# EAGLE design TDA2003-Amplifier (EAGLE 7.2.0)
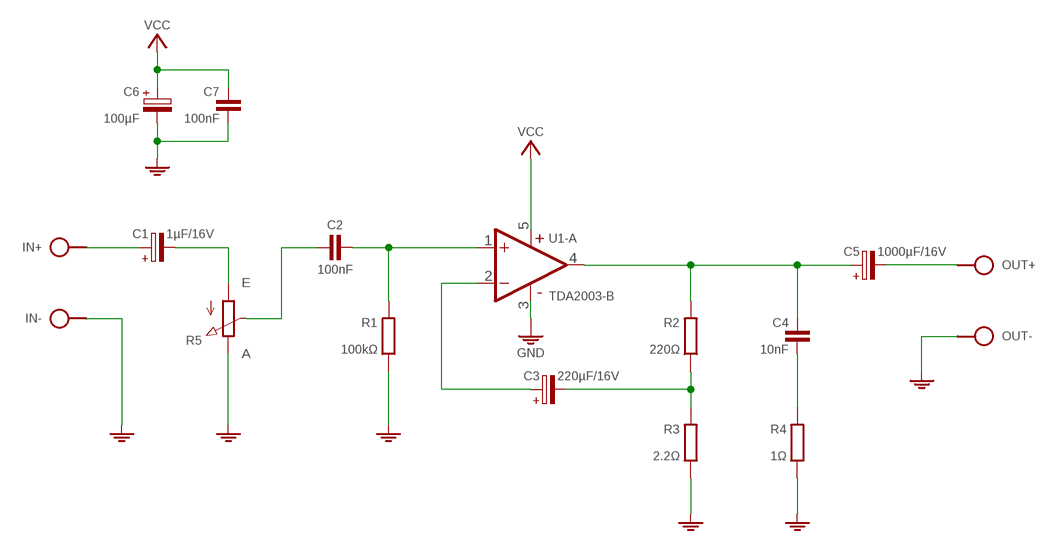
[diagram p0: schematic, sheet 1]

## Parts
C1  1µF/16V  CPOL-HE2,5-5  [E2,5-5]
C2  100nF  C-H050-024X044  [C050-024X044]
C3  220µF/16V  CPOL-HE2,5-5  [E2,5-5]
C4  10nF  C050-020X044/V  [C050-020X044/V]
C5  1000µF/16V  CPOL-HE5-5  [E5-5]
C6  100µF  CPOLE5-5/V  [E5-5/V]
C7  100nF  C050-024X044  [C050-024X044]
IN  SPAD+--+  [SPAD-+]
OUT  SPAD+-+-  [SPAD+-]
R1  100kΩ  R0204/10  [0204/10]
R2  220Ω  R0204/10  [0204/10]
R3  2.2Ω  R0204/10  [0204/10]
R4  1Ω  R0207/10  [0207/10]
R5  POT  [POT]
S1  VCC_GNDPWR-L  [PWR-L]
U1  TDA2003-B  [TO220-B5]

## Nets
GND: C6.- C7.2 IN.1 OUT.1 R1.2 R3.2 R4.2 R5.E S1.1 U1.3(-B:V-)
N$1: C4.1 C5.+ R2.1 U1.4(-A:OUT)
N$2: C4.2 R4.1
N$3: C5.- OUT.2
N$4: C1.- R5.A
N$5: C3.- R2.2 R3.1
N$6: C3.+ U1.2(-A:-IN)
N$7: C2.2 R1.1 U1.1(-A:+IN)
N$8: C2.1 R5.S
N$9: C1.+ IN.2
VCC: C6.+ C7.1 S1.2 U1.5(-B:V+)

## Library data of the parts
C1 C3 C5 = c:CPOL-H
C2 = c:C-H
C4 C7 = c:C: CAPACITOR, European symbol
C6 = c:CPOL: POLARIZED CAPACITOR, European symbol
IN OUT = pad:SPAD+-
R1-R4 = r:R: RESISTOR, European symbol
R5 = r:POT
S1 = pad:VCC_GND
U1 = ic:TDA2003

## Board
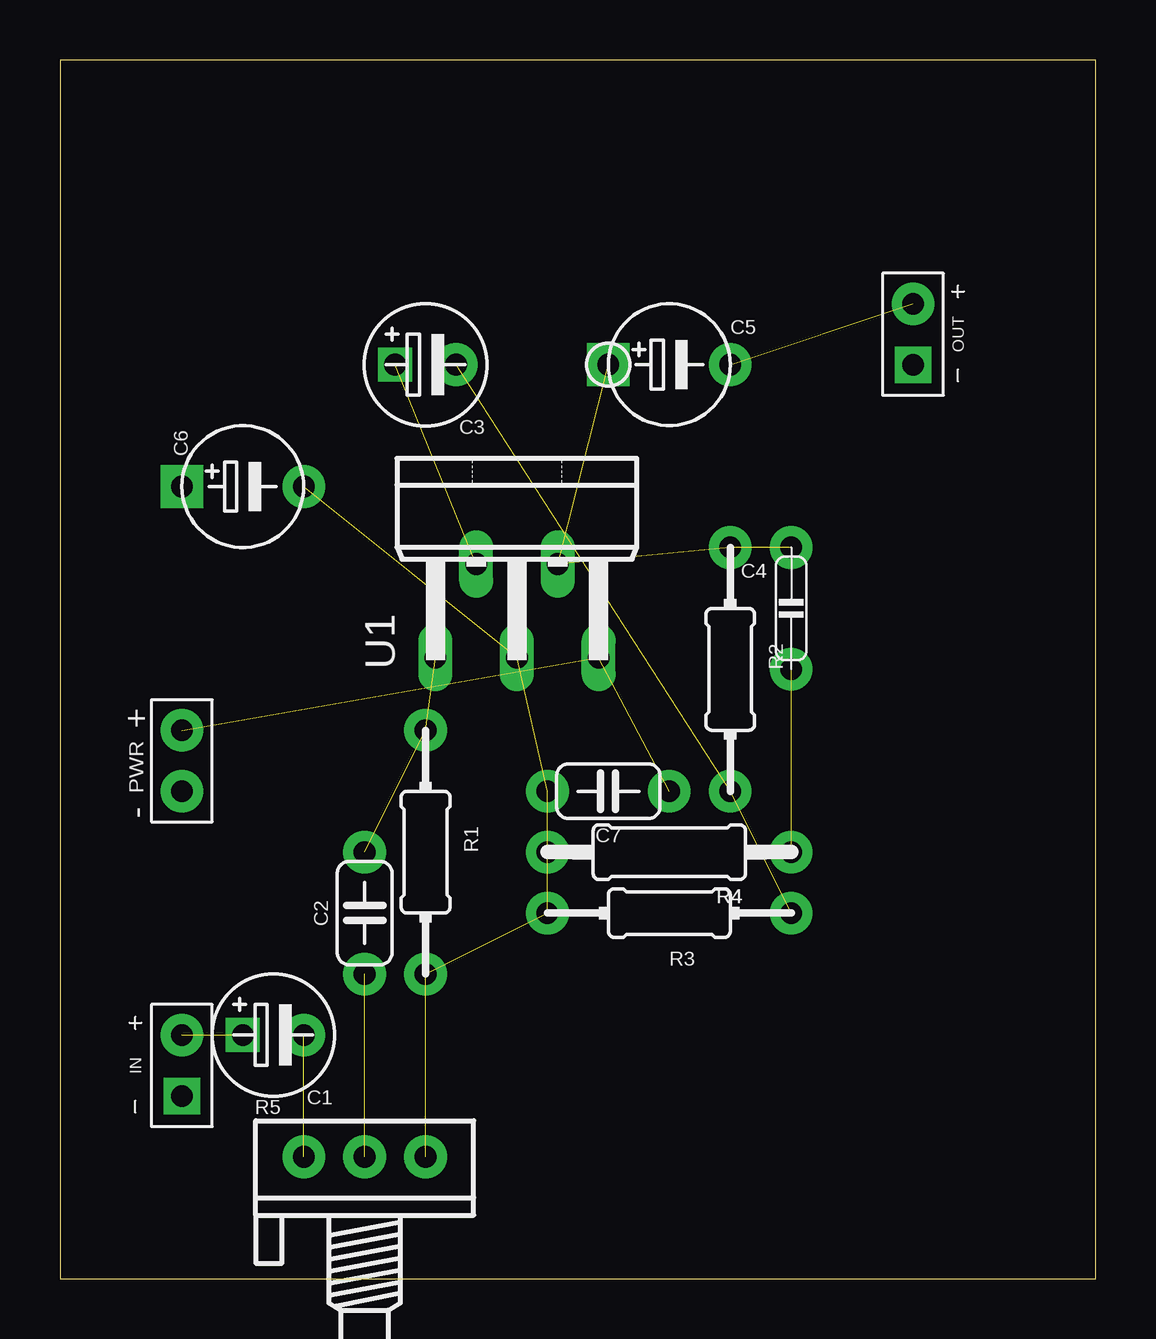
[diagram p1: board, top side]
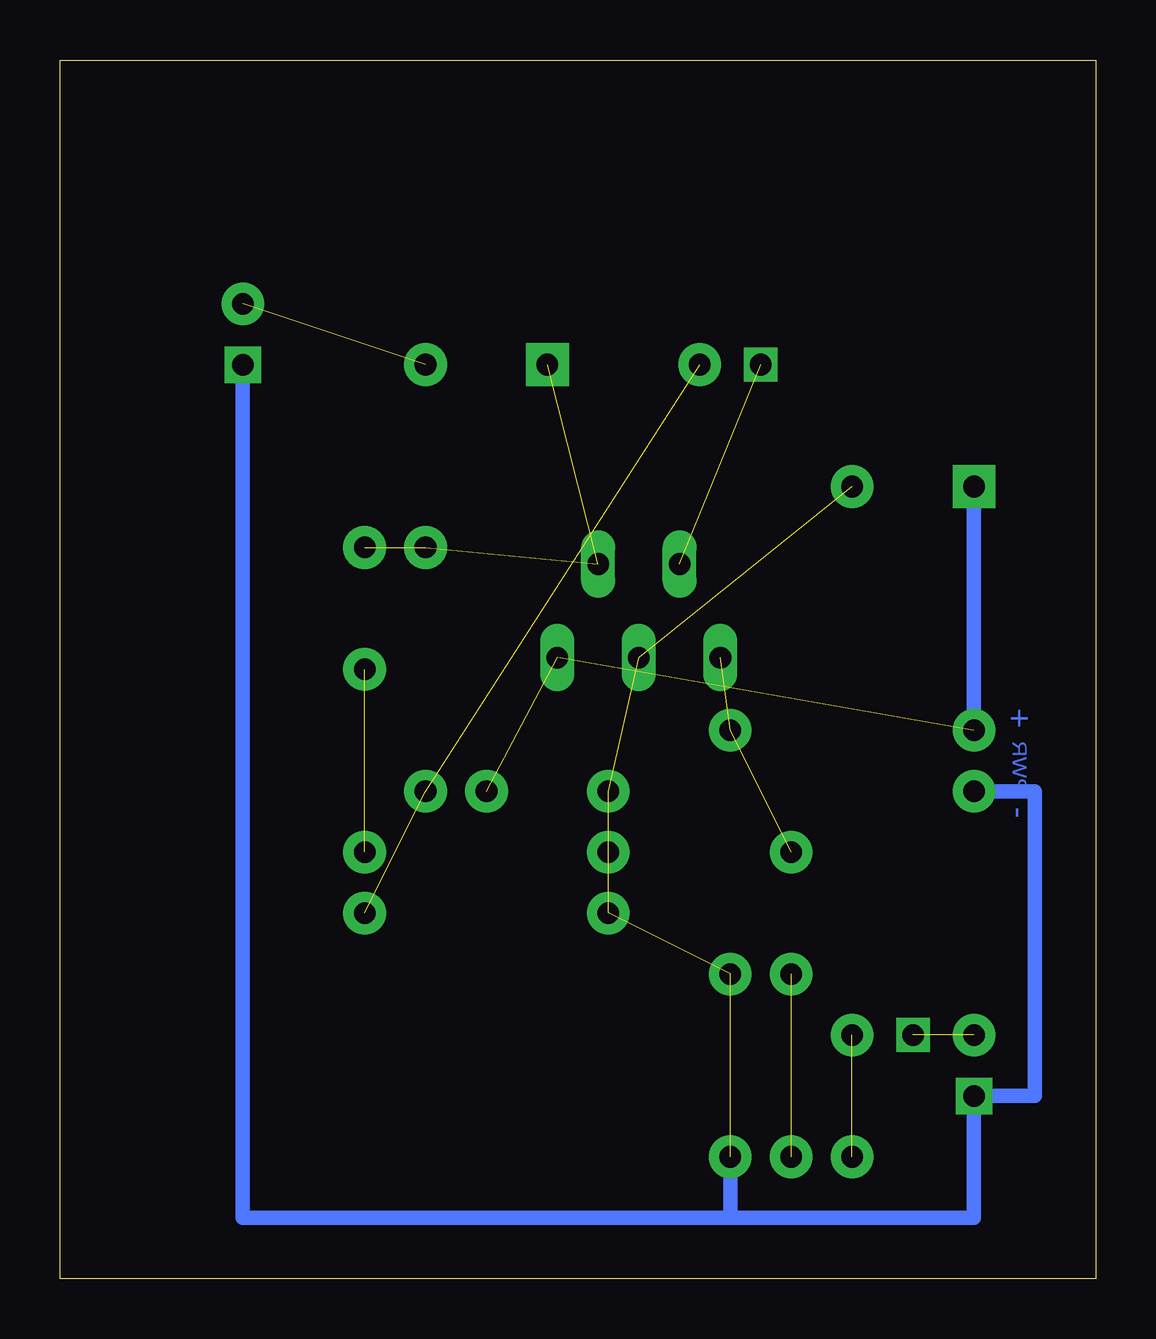
[diagram p2: board, bottom side, seen from below]

Size 43.18 x 50.8 mm. Coordinates in mm from the lower left corner, seen from the top.
Outline: 0,0 43.18,0 43.18,50.8 0,50.8 0,0
Copper layers (1*16): Top 0.035mm / dielectric 1.5mm / Bottom 0.035mm
Design rules "default": minimum track width 10mil, minimum drill 24mil, track to track 8mil, track to pad 8mil, pad to pad 8mil, via to via 8mil, smd to smd 8mil, copper to edge 40mil, drill to drill 8mil, minimum pad ring 10mil, minimum via ring 8mil, stop-mask expansion 4mil, vias tented up to drill 0mil, thermal gap 10mil

### Footprints (pad centres in the part's own frame; a part is rotated, then mirrored left to right if it is on the bottom)
E2,5-5 = drill 0.9 square: + 1.27,0 | drill 0.9 pad 1.778: - -1.27,0
C050-024X044 = drill 0.9 pad 1.778: 1 -2.54,0; 2 2.54,0
C050-020X044/V = drill 0.9 pad 1.778: 1 0,2.54; 2 0,-2.54
E5-5 = drill 0.9 pad 1.778 square: + -2.54,0 | drill 0.9 pad 1.778: - 2.54,0
E5-5/V = drill 0.9 pad 1.778 square: + 0,2.54 | drill 0.9 pad 1.778: - 0,-2.54
SPAD-+ = drill 0.9 pad 1.524 square: 1 0,-1.27 | drill 0.9 pad 1.778: 2 0,1.27
SPAD+- = drill 0.9 pad 1.524 square: 1 0,-1.27 | drill 0.9 pad 1.778: 2 0,1.27
0204/10 = drill 0.9 pad 1.778: 1 -5.08,0; 2 5.08,0
0207/10 = drill 0.9 pad 1.778: 1 -5.08,0; 2 5.08,0
POT = drill 0.9 pad 1.778: A -2.54,0; E 2.54,0; S 0,0
PWR-L = drill 0.9 pad 1.778: 1 0,0; 2 0,2.54
TO220-B5 = drill 0.9 long: 1 -3.4,-8.4; 2 -1.7,-4.5; 3 0,-8.4; 4 1.7,-4.5; 5 3.4,-8.4

### Placement (x,y rotation side)
C1  8.89,10.16 180 top
C2  12.7,15.24 90 top
C3  15.24,38.1 180 top
C4  30.48,27.94 0 top
C5  25.4,38.1 0 top
C6  7.62,33.02 90 top
C7  22.86,20.32 180 top
IN  5.08,8.89 0 top
OUT  35.56,39.37 0 top
R1  15.24,17.78 270 top
R2  27.94,25.4 270 top
R3  25.4,15.24 180 top
R4  25.4,17.78 180 top
R5  12.7,5.08 0 top
S1  5.08,20.32 0 top
U1  19.05,34.29 0 top

### Tracks (layer width: path | path; a pad name or v marks a point on that pad's centre or on a via)
GND  (6 unrouted)
  Bottom 0.61: OUT.1 35.56,2.54 15.24,2.54 | R5.E 15.24,2.54 | 15.24,2.54 5.08,2.54 IN.1 2.54,7.62 2.54,20.32 S1.1
N$1  (3 unrouted)
N$2  (1 unrouted)
N$3  (1 unrouted)
N$4  (1 unrouted)
N$5  (2 unrouted)
N$6  (1 unrouted)
N$7  (2 unrouted)
N$8  (1 unrouted)
N$9  (1 unrouted)
VCC  (2 unrouted)
  Bottom 0.61: S1.2 C6.+